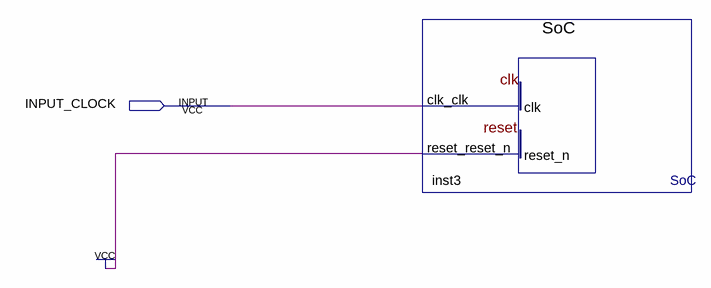
[diagram p0: schematic sheet]
// Quartus schematic TopLevel.bdf as structural Verilog: 1 symbols, 1 pins
module TopLevel (
  input  INPUT_CLOCK
);

  SoC inst3 (.clk_clk(INPUT_CLOCK), .reset_reset_n(1'b1));
endmodule
